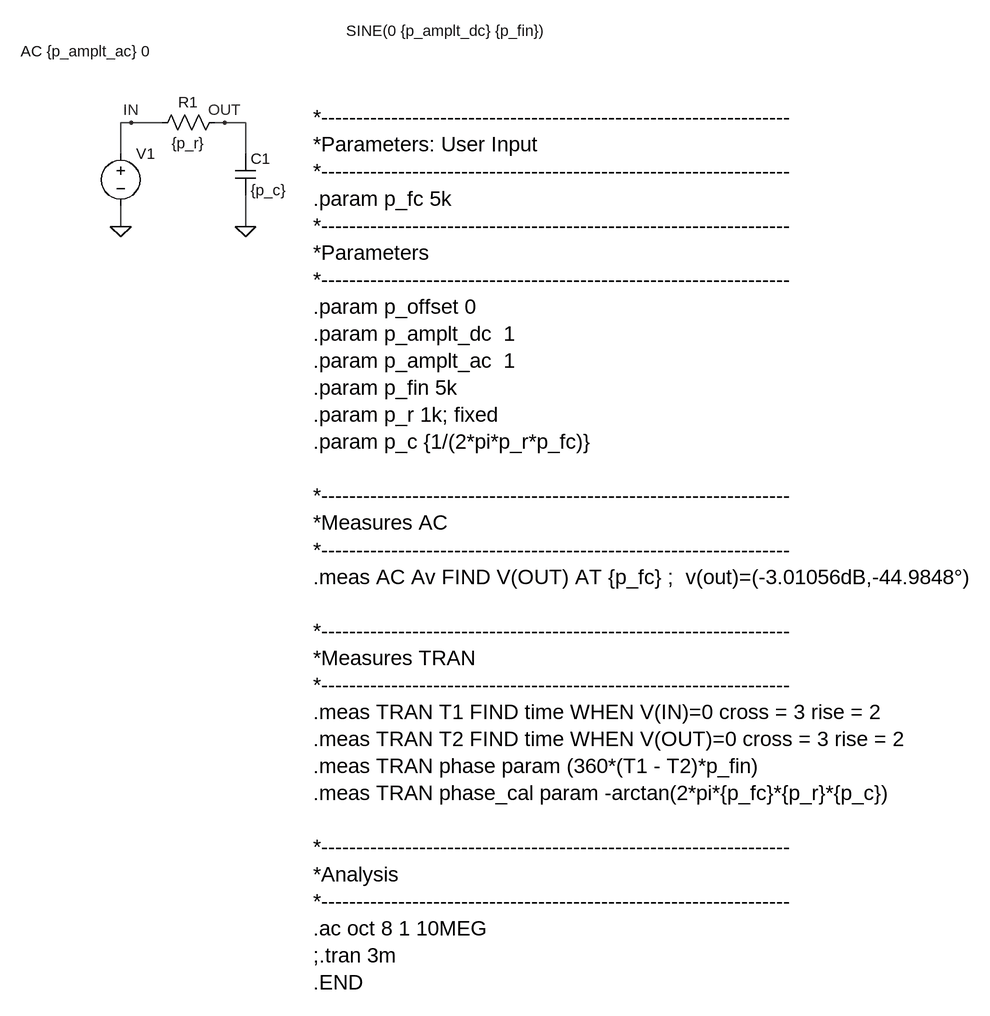
[diagram p0: schematic LPF_PHASE.asc]
LPF_PHASE.asc, the LTspice schematic file:
Version 4
SHEET 1 1476 1424
WIRE 96 80 80 80
WIRE 144 80 96 80
WIRE 240 80 224 80
WIRE 272 80 240 80
WIRE 80 128 80 80
WIRE 272 128 272 80
WIRE 80 240 80 208
WIRE 272 240 272 192
FLAG 80 240 0
FLAG 96 80 IN
FLAG 240 80 OUT
FLAG 272 240 0
SYMBOL voltage 80 112 R0
WINDOW 3 657 -173 Right 2
WINDOW 123 48 -142 Right 2
WINDOW 39 0 0 Left 0
SYMATTR Value SINE(0 {p_amplt_dc} {p_fin})
SYMATTR Value2 AC {p_amplt_ac} 0
SYMATTR InstName V1
SYMBOL res 240 64 R90
WINDOW 0 0 56 VBottom 2
WINDOW 3 32 56 VTop 2
SYMATTR InstName R1
SYMATTR Value {p_r}
SYMBOL cap 256 128 R0
SYMATTR InstName C1
SYMATTR Value {p_c}
TEXT 376 72 Left 3 !*-------------------------------------------------------------------\n*Parameters: User Input\n*-------------------------------------------------------------------\n.param p_fc 5k\n*-------------------------------------------------------------------\n*Parameters\n*-------------------------------------------------------------------\n.param p_offset 0\n.param p_amplt_dc  1\n.param p_amplt_ac  1\n.param p_fin 5k\n.param p_r 1k; fixed\n.param p_c {1/(2*pi*p_r*p_fc)}\n \n*-------------------------------------------------------------------\n*Measures AC\n*-------------------------------------------------------------------\n.meas AC Av FIND V(OUT) AT {p_fc} ;  v(out)=(-3.01056dB,-44.9848°)\n \n*-------------------------------------------------------------------\n*Measures TRAN\n*-------------------------------------------------------------------\n.meas TRAN T1 FIND time WHEN V(IN)=0 cross = 3 rise = 2\n.meas TRAN T2 FIND time WHEN V(OUT)=0 cross = 3 rise = 2\n.meas TRAN phase param (360*(T1 - T2)*p_fin)\n.meas TRAN phase_cal param -arctan(2*pi*{p_fc}*{p_r}*{p_c})\n \n*-------------------------------------------------------------------\n*Analysis\n*-------------------------------------------------------------------\n.ac oct 8 1 10MEG\n;.tran 3m\n.END

The netlist it stands for:
* LPF_PHASE.asc
V1 IN 0 SINE(0 {p_amplt_dc} {p_fin}) AC {p_amplt_ac} 0
R1 OUT IN {p_r}
C1 OUT 0 {p_c}
*-------------------------------------------------------------------
*Parameters: User Input
*-------------------------------------------------------------------
.param p_fc 5k
*-------------------------------------------------------------------
*Parameters
*-------------------------------------------------------------------
.param p_offset 0
.param p_amplt_dc  1
.param p_amplt_ac  1
.param p_fin 5k
.param p_r 1k; fixed
.param p_c {1/(2*pi*p_r*p_fc)}
*-------------------------------------------------------------------
*Measures AC
*-------------------------------------------------------------------
.meas AC Av FIND V(OUT) AT {p_fc} ;  v(out)=(-3.01056dB,-44.9848°)
*-------------------------------------------------------------------
*Measures TRAN
*-------------------------------------------------------------------
.meas TRAN T1 FIND time WHEN V(IN)=0 cross = 3 rise = 2
.meas TRAN T2 FIND time WHEN V(OUT)=0 cross = 3 rise = 2
.meas TRAN phase param (360*(T1 - T2)*p_fin)
.meas TRAN phase_cal param -arctan(2*pi*{p_fc}*{p_r}*{p_c})
*-------------------------------------------------------------------
*Analysis
*-------------------------------------------------------------------
.ac oct 8 1 10MEG
;.tran 3m
.END
.backanno
.end

* Results of the author's LTspice run, read from the files saved beside the schematic
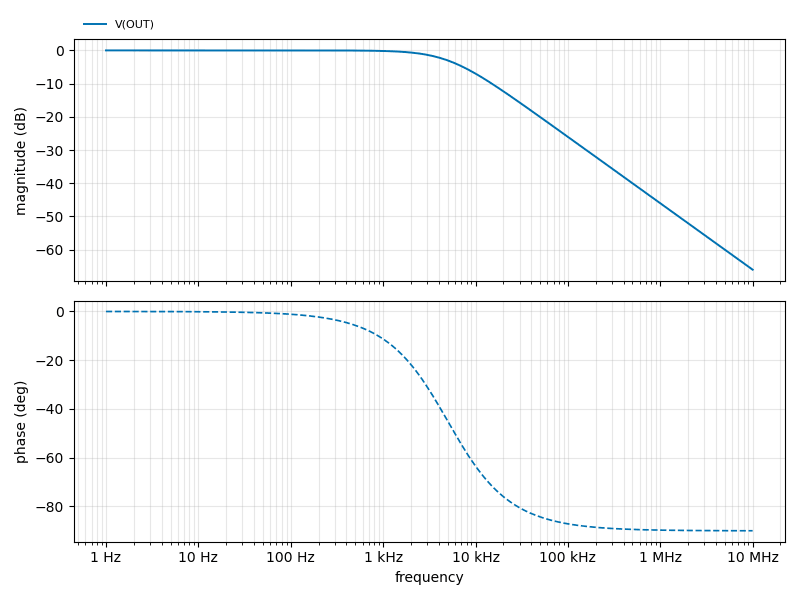
[diagram p1: AC Analysis of LPF_PHASE.asc, plotted from the saved traces]
* AC Analysis, 1 run:
*   V(OUT): -0.00 dB at 1 Hz, -66.02 dB at 10 MHz, peak -0.00 dB at 1 Hz, 3 dB below the peak at 4.996 kHz
* From the log:
*   av: v(out)=(-3.01018dB,-44.9547°) at 5000